# Altium schematic sheet CAN Bus, SIM and eMMC C.SchDoc
size 219 x 165 mm
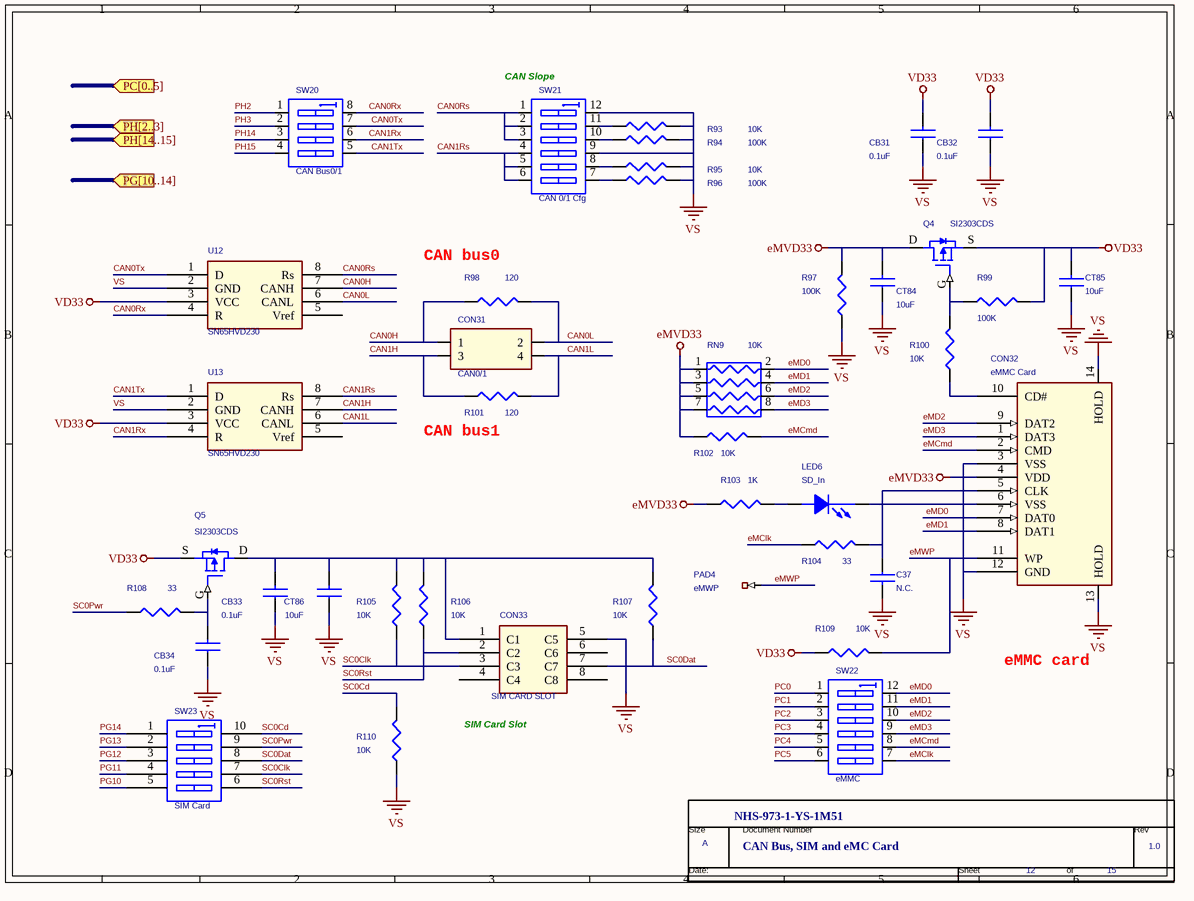
[diagram p0: CAN Bus, SIM and eMMC C.SchDoc]

## Parts
*  RevCode: 1.0  Page Size: A  Page Number: 12  Page Count: 15  Doc: CAN Bus, SIM and eMC Card  OrgName: NHS-973-1-YS-1M51  (hidden comment: TitleBlock0N)  (graphical)
C37  N.C.  [C0603]
CB31  0.1uF  [C0603]
CB32  0.1uF  [C0603]
CB33  0.1uF  [C0603]
CB34  0.1uF  [C0603]
CON31  CAN0/1  [Header_2x2_2.54mm]
CON32  eMMC Card  [AXA2R63061]
CON33  SIM CARD SLOT  [SIM-CARD]
CT84  10uF  [C0603]
CT85  10uF  [C0603]
CT86  10uF  [C0603]
LED6  SD_In  [LED_0603]
PAD4  eMWP  [1PAD 1.25x1.25mm]
Q4  SI2303CDS  [SOT-23]
Q5  SI2303CDS  [SOT-23]
R93  10K  [R0603]
R94  100K  [R0603]
R95  10K  [R0603]
R96  100K  [R0603]
R97  100K  [R0603]
R98  120  [R0603]
R99  100K  [R0603]
R100  10K  [R0603]
R101  120  [R0603]
R102  10K  [R0603]
R103  1K  [R0603]
R104  33  [R0603]
R105  10K  [R0603]
R106  10K  [R0603]
R107  10K  [R0603]
R108  33  [R0603]
R109  10K  [R0603]
R110  10K  [R0603]
RN9  10K  [8P4RA]
SW20  CAN Bus0/1  [DIPSWx4_2.54mm]
SW21  CAN 0/1 Cfg  [DIPSWx6_2.54mm]
SW22  eMMC  [DIPSWx6_2.54mm]
SW23  SIM Card  [DIPSWx5_2.54mm]
U12  SN65HVD230  [SOIC-8]
U13  SN65HVD230  [SOIC-8]

## Ports
PC[0..5] (in), PG[10..14] (in), PH[2..3] (in), PH[14..15] (in)

## Nets
eMVD33: CON32.4(VDD) CT84.2 Q4.D(DRAIN) R97.2 R102.2 R103.1 RN9.1(R1) RN9.3(R2) RN9.5(R3) RN9.7(R4)
VD33: CB31.2 CB32.2 CT85.2 Q4.S(SOURCE) Q5.S(SOURCE) R99.2 R109.1 U12.3(VCC) U13.3(VCC)
VS: C37.2 CB31.1 CB32.1 CB33.1 CB34.1 CON32.3(VSS) CON32.12(GND) CON32.13(HOLD) CON32.14(HOLD) CON33.5(C5) CT84.1 CT85.1 CT86.1 R93.2 R94.2 R95.2 R96.2 R97.1 R110.2 SW21.9(B4) SW21.12(B1) U12.2(GND) U13.2(GND)
CAN0H: CON31.1 R98.1 U12.7(CANH)
CAN0L: CON31.2 R98.2 U12.6(CANL)
CAN0Rs: SW21.1(A1) SW21.2(A2) SW21.3(A3) U12.8(Rs)
CAN0Rx: SW20.8(B1) U12.4(R)
CAN0Tx: SW20.7(B2) U12.1(D)
CAN1H: CON31.3 R101.1 U13.7(CANH)
CAN1L: CON31.4 R101.2 U13.6(CANL)
CAN1Rs: SW21.4(A4) SW21.5(A5) SW21.6(A6) U13.8(Rs)
CAN1Rx: SW20.6(B3) U13.4(R)
CAN1Tx: SW20.5(B4) U13.1(D)
eMClk: R104.2 SW22.7(B6)
eMCmd: CON32.2(CMD) R102.1 SW22.8(B5)
eMD0: CON32.7(DAT0) RN9.2(R1) SW22.12(B1)
eMD1: CON32.8(DAT1) RN9.4(R2) SW22.11(B2)
eMD2: CON32.9(DAT2) RN9.6(R3) SW22.10(B3)
eMD3: CON32.1(DAT3) RN9.8(R4) SW22.9(B4)
eMWP: CON32.11(WP) PAD4.\ R109.2
PC0: SW22.1(A1)
PC1: SW22.2(A2)
PC2: SW22.3(A3)
PC3: SW22.4(A4)
PC4: SW22.5(A5)
PC5: SW22.6(A6)
PG10: SW23.5(A5)
PG11: SW23.4(A4)
PG12: SW23.3(A3)
PG13: SW23.2(A2)
PG14: SW23.1(A1)
PH2: SW20.1(A1)
PH3: SW20.2(A2)
PH14: SW20.3(A3)
PH15: SW20.4(A4)
SC0Cd: R110.1 SW23.10(B1)
SC0Clk: CON33.3(C3) R105.2 SW23.7(B4)
SC0Dat: CON33.7(C7) R107.2 SW23.8(B3)
SC0Pwr: R108.1 SW23.9(B2)
SC0Rst: CON33.2(C2) R106.2 SW23.6(B5)
NetC37_1: C37.1 CON32.5(CLK) R104.1
NetCB33_2: CB33.2 CON33.1(C1) CT86.2 Q5.D(DRAIN) R105.1 R106.1 R107.1
NetCB34_2: CB34.2 Q5.G(GATE) R108.2
NetCON32_6: CON32.6(VSS) LED6.2(CATHODE)
NetCON32_10: CON32.10(CD#) R100.1
NetLED6_1: LED6.1(ANODE) R103.2
NetQ4_G: Q4.G(GATE) R99.1 R100.2
NetR93_1: R93.1 SW21.11(B2)
NetR94_1: R94.1 SW21.10(B3)
NetR95_1: R95.1 SW21.8(B5)
NetR96_1: R96.1 SW21.7(B6)

Not connected (* = marked no-connect by the designer): CON33 4(C4) 6(C6) 8(C8); U12 5(Vref); U13 5(Vref)

## Notes on the sheet
- (near SW21) CAN Slope
- (near R98) CAN bus0
- (near R101) CAN bus1
- eMMC card
- (near CON33) SIM Card Slot
- (in symbol TitleBlock0N) Size; Document Number; Rev; Date:; Sheet; of

## Library data of the parts
C37 CB31-CB34 CT84-CT86 = CAP NP
CON31 = CON4A
CON32 = AXA2R63061_0
CON33 = HEADER 6_0: Part No: C0612-08DAJBOXR
LED6 = LED
PAD4 = 1PAD
Q4 Q5 = SI2303CDS_1
R93-R110 = R
  R93-R96 R98 R101 R105-R108 R110: Package: R0402
RN9 = R-PACK8_0: Package: 8P4RA
SW20 = SW DIP-4_0
SW21 SW22 = SW DIP-6_1
SW23 = SW DIP-5
* = TitleBlock0N: Page Create Date: April 25, 1995
U12 U13 = SN65HVD230: Package: SO-8